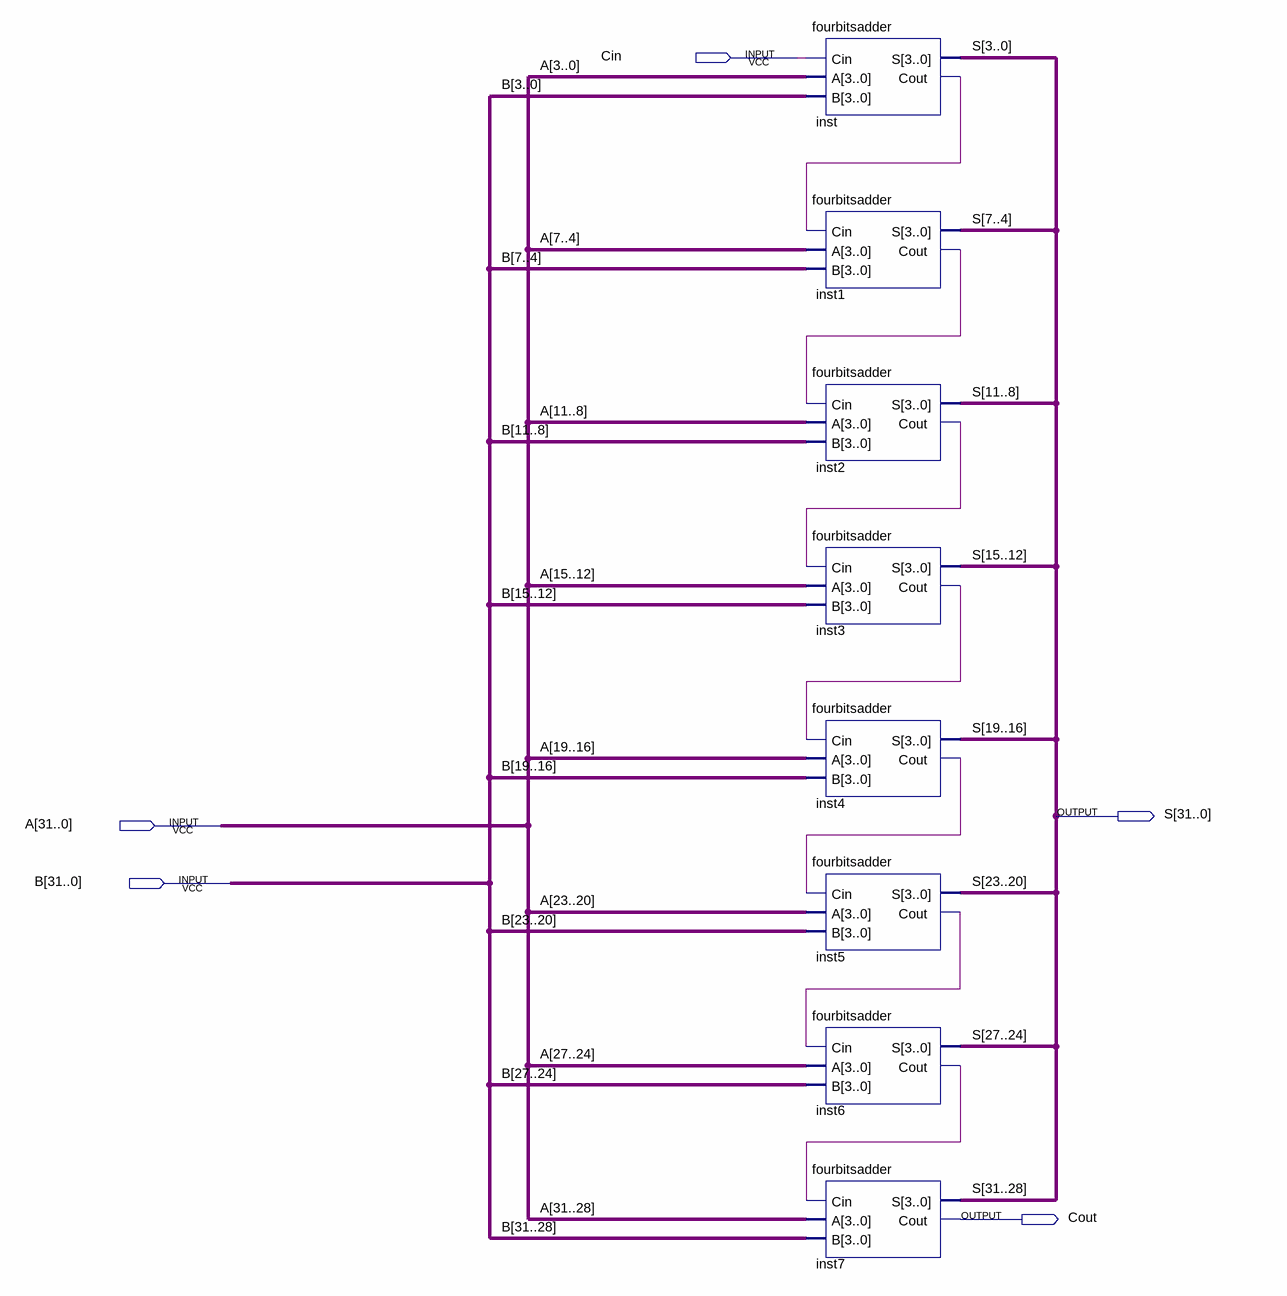
[diagram p0: schematic sheet]
// Quartus schematic thirtytwobitadder.bdf as structural Verilog: 8 symbols, 5 pins
module thirtytwobitadder (
  input  Cin,
  input  [31:0] A,
  input  [31:0] B,
  output [31:0] S,
  output Cout
);

  wire inst1_cout, inst2_cout, inst3_cout, inst4_cout, inst5_cout, inst6_cout, inst_cout;

  fourbitsadder inst (.Cin(Cin), .A(A[3:0]), .B(B[3:0]), .S(S[3:0]), .Cout(inst_cout));
  fourbitsadder inst1 (.Cin(inst_cout), .A(A[7:4]), .B(B[7:4]), .S(S[7:4]), .Cout(inst1_cout));
  fourbitsadder inst2 (.Cin(inst1_cout), .A(A[11:8]), .B(B[11:8]), .S(S[11:8]), .Cout(inst2_cout));
  fourbitsadder inst3 (.Cin(inst2_cout), .A(A[15:12]), .B(B[15:12]), .S(S[15:12]), .Cout(inst3_cout));
  fourbitsadder inst4 (.Cin(inst3_cout), .A(A[19:16]), .B(B[19:16]), .S(S[19:16]), .Cout(inst4_cout));
  fourbitsadder inst5 (.Cin(inst4_cout), .A(A[23:20]), .B(B[23:20]), .S(S[23:20]), .Cout(inst5_cout));
  fourbitsadder inst6 (.Cin(inst5_cout), .A(A[27:24]), .B(B[27:24]), .S(S[27:24]), .Cout(inst6_cout));
  fourbitsadder inst7 (.Cin(inst6_cout), .A(A[31:28]), .B(B[31:28]), .S(S[31:28]), .Cout(Cout));
endmodule
